# EasyEDA Pro project slimevr_mumo_breakout_module_v1_re.eprj

# Schematic Schematic1
Board Name: Board1; Create Date: 2025-10-01; Page Name: P1; Project Name: slimevr_mumo_breakout_module_v1_re; Schematic Name: Schematic1; Update Date: 2025-10-01; Company: 嘉立创EDA; Page Size: A4; Version: V1.0
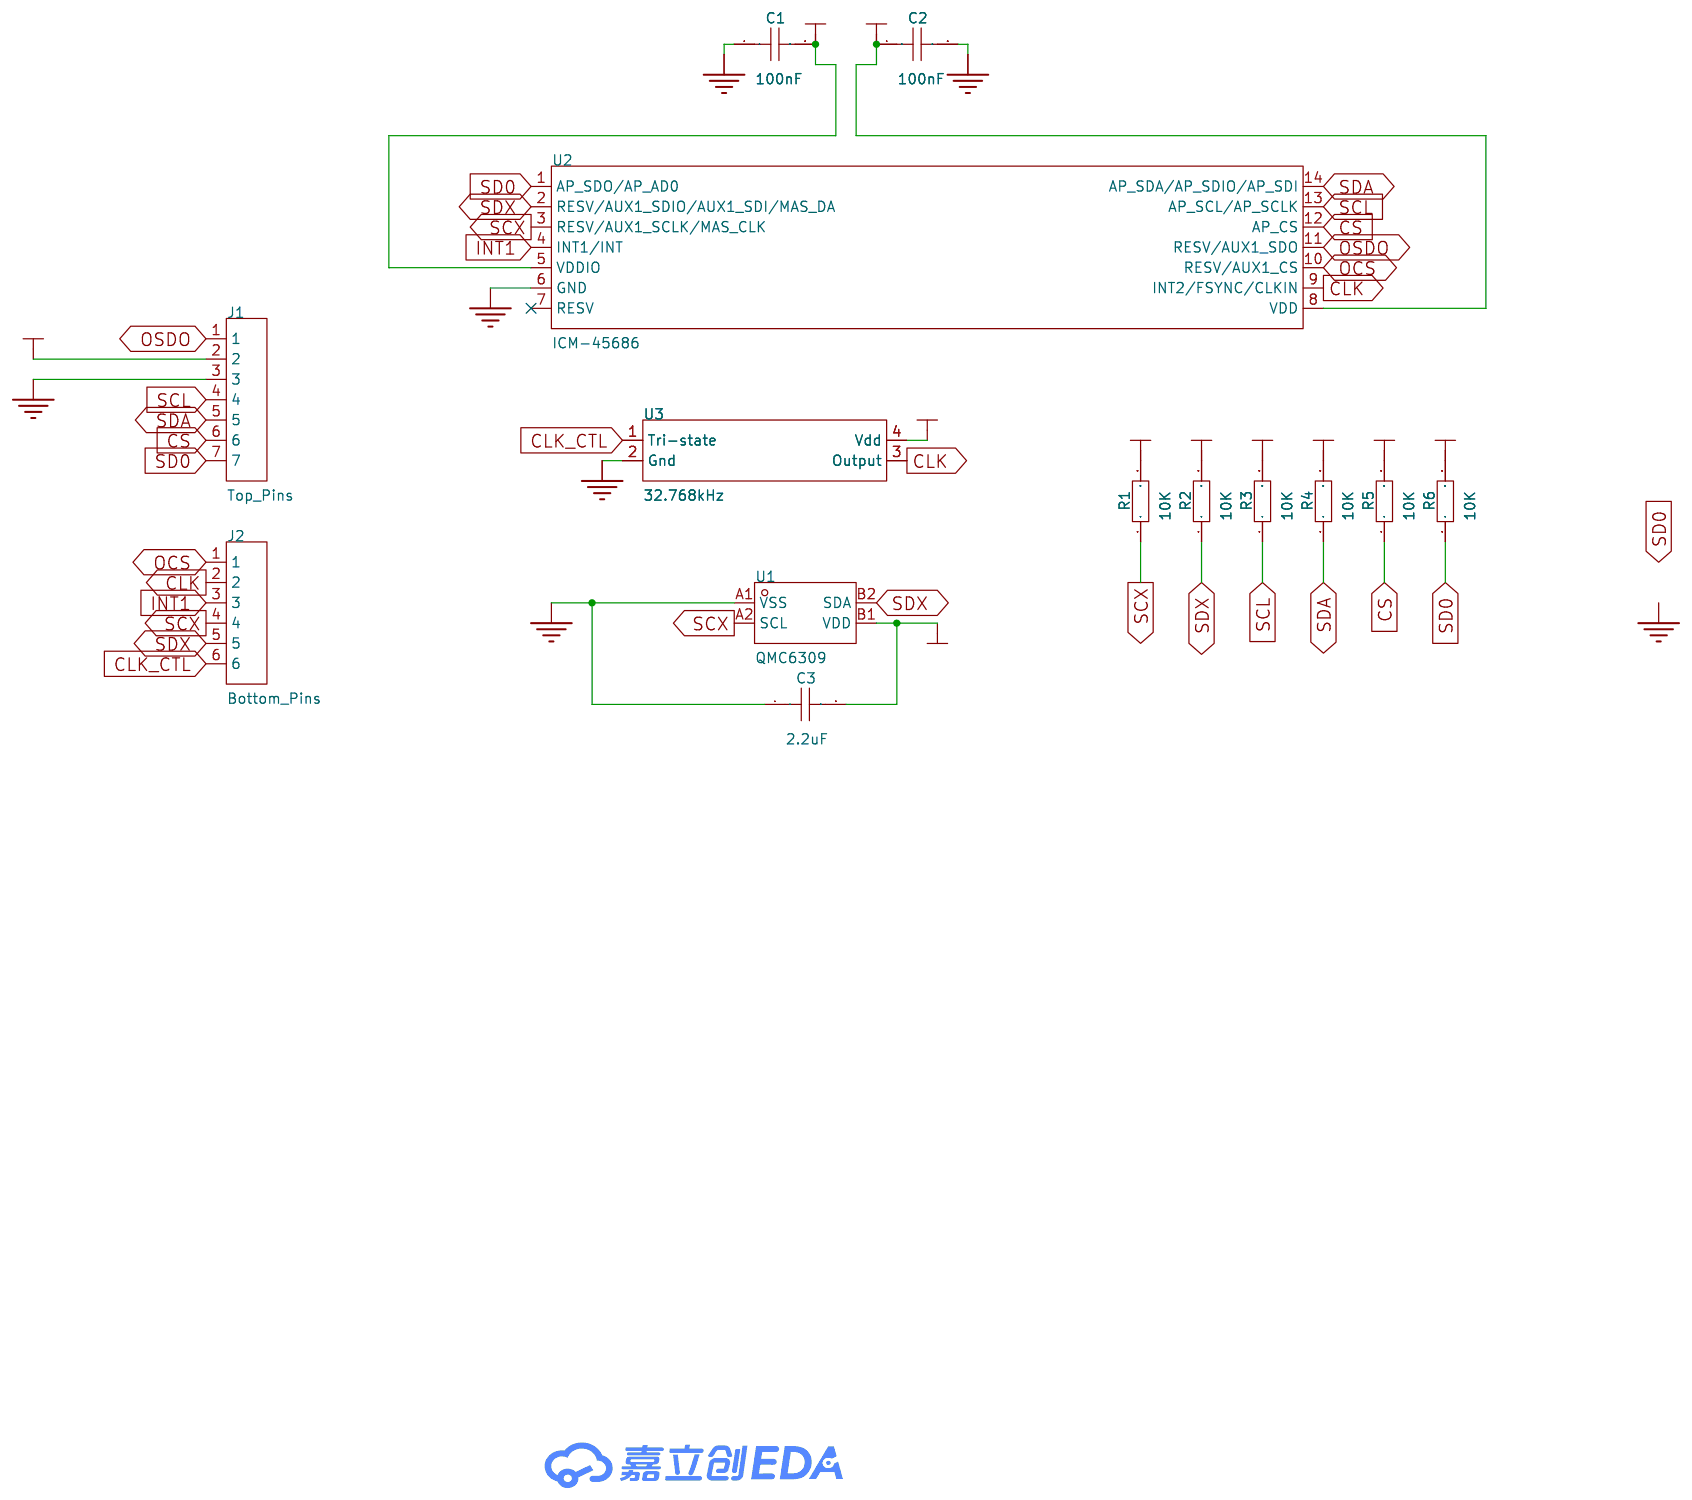
[diagram p0: schematic sheet]

## Parts
C1  100nF  [C0402]
C2  100nF  [C0402]
C3  2.2uF  [C0402]
J1  Top_Pins  [HDR-TH_7P-P2.54-V-M]
J2  Bottom_Pins  [HDR-TH_6P-P2.54-V-M]
R1  10K  [R0402]
R2  10K  [R0402]
R3  10K  [R0402]
R4  10K  [R0402]
R5  10K  [R0402]
R6  10K  [R0402]
U1  QMC6309  [X1-WLB0808-4_L0.8-W0.8-P0.40-TL]
U2  ICM-45686  [LGA-14_L3.0-W2.5-P0.50-TL]
U3  32.768kHz  [OSC-SMD_4P-L3.2-W2.5-BL]

## Library data of the parts
C1-C3 = CAP_0603: Supplier Footprint: 0603
J1 = HB-PH3-25417PB2GOP: LCSC Part Name: 1x7P 间距:2.54mm 方针 直插; Supplier Part: C6332200; Manufacturer: HANBO(汉博); Supplier Footprint: 插件,P=2.54mm; JLCPCB Part Class: 扩展库; Datasheet: https://item.szlcsc.com/datasheet/HB-PH3-25417PB2GOP/7280440.html; Supplier: LCSC; Pin Structure: 1x7P; Pitch: 2.54mm; Row Spacing: 2.54mm; Circluar Pins/Square Pins: 方针; Mounting Type: 直插; Number of Rows: 单排; Number of Pins: 7P; Current Rating: 3A; Voltage Rating (Max): 250V; Length of Mating Pin: 6mm; Insulation Height: 2.54mm; Length of End Connection Pin: 3mm; Contact Material: 黄铜; Contact Plating: 金; Operating Temperature: -40℃~+105℃; Color: 黑色
J2 = HB-PH3-25416PB2GOP: LCSC Part Name: 1x6P 间距:2.54mm 方针 直插; Supplier Part: C6332199; Manufacturer: HANBO(汉博); Supplier Footprint: 插件,P=2.54mm; JLCPCB Part Class: 扩展库; Datasheet: https://item.szlcsc.com/datasheet/HB-PH3-25416PB2GOP/7280439.html; Supplier: LCSC; Pin Structure: 1x6P; Pitch: 2.54mm; Row Spacing: 2.54mm; Circluar Pins/Square Pins: 方针; Mounting Type: 直插; Number of Rows: 单排; Number of Pins: 6P; Current Rating: 3A; Voltage Rating (Max): 250V; Length of Mating Pin: 6mm; Insulation Height: 2.54mm; Length of End Connection Pin: 3mm; Contact Material: 黄铜; Contact Plating: 金; Operating Temperature: -40℃~+105℃; Color: 黑色
R1-R6 = Res_0603: Supplier Footprint: 0603
U1 = QMC6309: Supplier Part: C5439871; Manufacturer: QST(上海矽睿); Supplier Footprint: WLCSP-4(0.8x0.8); JLCPCB Part Class: 扩展库; Datasheet: https://item.szlcsc.com/datasheet/QMC6309/6319593.html; Supplier: LCSC
U2 = ICM-45686: Supplier Part: C22459454; Manufacturer: TDK InvenSense(应美盛); Supplier Footprint: LGA-14(3x2.5); JLCPCB Part Class: 扩展库; Datasheet: https://item.szlcsc.com/datasheet/ICM-45686/24135842.html; Supplier: LCSC
U3 = YF4032K76833T8188081: Supplier Part: C709192; Manufacturer: JWT(晶威特); Supplier Footprint: SMD3225-4P; JLCPCB Part Class: 扩展库; Datasheet: https://atta.szlcsc.com/upload/public/pdf/source/20200819/C709192_B630C027D229E0E1DC55BE73A6BD301E.pdf; Supplier: LCSC; Voltage - Supply: 3.3V; Current - Supply: 70uA; Frequency Stability: ±10ppm; Operating Temperature: -40℃~+85℃

## Nets
+3V3: C1.2 C2.1 C3.2 J1.2 R1.2 R2.2 R3.2 R4.2 R5.2 R6.2 U1.B1(VDD) U2.5(VDDIO) U2.8(VDD) U3.4(Vdd)
GND: C1.1 C2.2 C3.1 J1.3 U1.A1(VSS) U2.6(GND) U3.2(Gnd)
CLK: J2.2 U2.9(INT2/FSYNC/CLKIN) U3.3(Output)
CLK_CTL: J2.6 U3.1(Tri-state)
CS: J1.6 R5.1 U2.12(AP_CS)
INT1: J2.3 U2.4(INT1/INT)
OCS: J2.1 U2.10(RESV/AUX1_CS)
OSDO: J1.1 U2.11(RESV/AUX1_SDO)
SCL: J1.4 R3.1 U2.13(AP_SCL/AP_SCLK)
SCX: J2.4 R1.1 U1.A2(SCL) U2.3(RESV/AUX1_SCLK/MAS_CLK)
SD0: J1.7 R6.1 U2.1(AP_SDO/AP_AD0)
SDA: J1.5 R4.1 U2.14(AP_SDA/AP_SDIO/AP_SDI)
SDX: J2.5 R2.1 U1.B2(SDA) U2.2(RESV/AUX1_SDIO/AUX1_SDI/MAS_DA)

Not connected (* = marked no-connect by the designer): U2 7(RESV)*

# Board PCB1
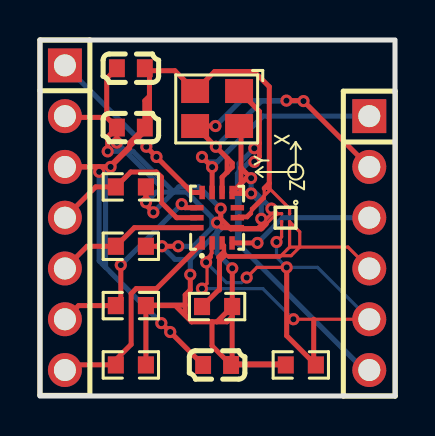
[diagram p1: board, top side]
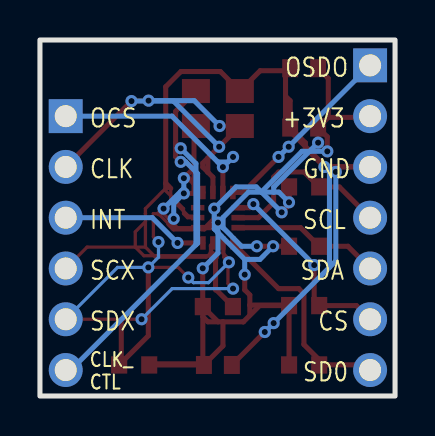
[diagram p2: board, bottom side, seen from below]

Outline 17.78 x 17.81 mm; copper layers: Top Layer, Bottom Layer. Coordinates in mm from the lower left corner of the outline.
Outline path: rectangle 0,17.81 17.78,0
Stack: Top Layer 0.035mm / Dielectric1 1.51mm FR4 er 4.5 / Bottom Layer 0.035mm

## Design rules (mm)
template: JLCPCB Capability(Two Layers Board)
spacing copperThickness1oz (default): track to track 0.102, other pairs 0.152 to 0.3
spacing copperThickness2oz: track to track 0.203, other pairs 0.152 to 0.3
track width copperThickness1oz (default): min 0.127, default 0.254, max 2.54
track width copperThickness2oz: min 0.203, default 0.254, max 2.54
differential pair differentialPair (default): width min 0.127, default 0.254, max 2.54; gap min 0.152, default 0.152
via viaSize (default): diameter min 0.5, default 0.61, max 10; hole min 0.3, default 0.305, max 6.3

## Placement (name value [footprint] x y rotation side)
C1  100nF  [C0603]  4.55 13.43 180 top
C2  100nF  [C0603]  4.55 16.4 0 top
C3  2.2uF  [C0603]  8.87 1.55 0 top
J1  Top_Pins  [HDR-TH_7P-P2.54-V-M]  1.25 8.92 270 top
J2  Bottom_Pins  [HDR-TH_6P-P2.54-V-M]  16.49 7.65 270 top
R1  10K  [R0603]  8.87 4.48 0 top
R2  10K  [R0603]  13.06 1.55 180 top
R3  10K  [R0603]  4.55 10.46 0 top
R4  10K  [R0603]  4.55 7.49 0 top
R5  10K  [R0603]  4.55 4.52 0 top
R6  10K  [R0603]  4.55 1.56 0 top
U1  QMC6309  [X1-WLB0808-4_L0.8-W0.8-P0.40-TL]  12.3 8.92 270 top
U2  ICM-45686  [LGA-14_L3.0-W2.5-P0.50-TL]  8.87 8.92 90 top
U3  32.768kHz  [OSC-SMD_4P-L3.2-W2.5-BL]  8.87 14.38 180 top

## Footprints (pads in the part's own frame, mm; a bottom-side part is the same pattern mirrored in y, then rotated)
C0603
  rect 0.8x0.9 smd: 1(-0.7,0) 2(0.7,0)
HDR-TH_6P-P2.54-V-M
  rect 1.7x1.7 hole 1.1: 1(-6.35,0)
  round 1.7 hole 1.1: 2(-3.81,0) 3(-1.27,0) 4(1.27,0) 5(3.81,0) 6(6.35,0)
HDR-TH_7P-P2.54-V-M
  rect 1.7x1.7 hole 1.1: 1(-7.62,0)
  round 1.7 hole 1.1: 2(-5.08,0) 3(-2.54,0) 4(0,0) 5(2.54,0) 6(5.08,0) 7(7.62,0)
LGA-14_L3.0-W2.5-P0.50-TL
  rect 0.675x0.28 smd: 1(-1.262,0.75) 2(-1.262,0.25) 3(-1.262,-0.25) 4(-1.262,-0.75) 8(1.262,-0.75) 9(1.262,-0.25) 10(1.262,0.25) 11(1.262,0.75)
  rect 0.28x0.675 smd: 5(-0.5,-1.012) 6(0,-1.012) 7(0.5,-1.012) 12(0.5,1.012) 13(0,1.012) 14(-0.5,1.012)
OSC-SMD_4P-L3.2-W2.5-BL
  rect 1.4x1.2 smd: 1(-1.1,-0.875) 2(1.1,-0.875) 3(1.1,0.875) 4(-1.1,0.875)
R0603
  rect 0.806x0.864 smd: 1(-0.753,0) 2(0.753,0)
X1-WLB0808-4_L0.8-W0.8-P0.40-TL
  round 0.18 smd: A1(-0.2,0.2) A2(0.2,0.2) B1(-0.2,-0.2) B2(0.2,-0.2)

## Nets
As in the schematic.

Pads without a net: U2 7

## Via types
v1: diameter 0.61, hole 0.305, Top Layer to Bottom Layer, 37 vias

## Routing (per net, layer and track width the routed paths; a pad name or vN(x,y) marks a point on that pad's centre or on a via; arc(x,y) is an arc through that point)
+3V3: length 82.4
  Top Layer w0.163: 11.84,9.12 11.59,9.12 10.89,8.42 ; 11.84,9.12 11.34,8.61 ; 11.84,9.12 U1.B1 ; 10.89,8.42 U2.5 ; 10.89,8.42 11.15,8.42
  Top Layer w0.254: v1(5.31,9.69) 5.31,10.46 ; 9.62,3.97 R1.2 8.86,3.71 ; 9.62,3.97 9.62,1.61 ; 9.62,3.97 9.37,3.71 8.86,3.71 ; 10.07,10.14 10.07,10.63 ; 10.07,10.14 9.67,10.14 U2.8 10.07,10.63 ; 10.07,10.14 v1(10.57,10.14) ; 10.07,10.63 10.07,11.41 ; 10.07,10.63 10.34,10.9 v1(10.57,10.9) 10.07,11.41 ; 9.62,1.61 12.25,1.61 R2.2 C3.2 ; 9.62,1.61 C3.2 ; v1(6.92,7.49) v1(6.11,7.49) R4.2 ; R5.2 R6.2 ; R5.2 6.78,4.52 7.59,3.71 ; R5.2 5.33,4.55 7.27,4.55 ; 8.86,3.71 8.62,3.71 ; 8.62,3.71 8.62,2.51 C3.2 ; 8.62,3.71 7.59,3.71 ; C1.2 3.34,13.94 ; C1.2 v1(3.85,12.67) ; C1.2 3.39,12.97 v1(3.39,12.24) ; 3.34,13.94 3.34,15.89 C2.1 ; 3.34,13.94 1.31,13.94 J1.2 ; 11.84,9.12 v1(11.59,9.37) ; U3.4 10.07,13.41 10.07,11.41 ; 9.5,8.42 9.05,8.87 v1(9.05,9.37) ; 9.5,8.42 9.12,8.42 v1(8.87,8.67) ; 9.5,8.42 U2.5 ; 9.5,8.42 9.56,8.36 11.08,8.36 11.34,8.61 ; R3.2 5.31,9.56 v1(5.68,9.19) ; 7.27,4.55 7.27,5.06 7.53,5.31 v1(7.53,6.07) ; 7.27,4.55 7.27,4.04 ; v1(9.63,6.39) 9.63,4.48 ; 7.59,3.71 7.6,3.71 ; 11.08,8.61 v1(11.08,8.87)
  Bottom Layer w0.254: 8.61,8.42 7.68,7.49 v1(6.92,7.49) ; 8.61,8.42 8.61,8.93 7.34,10.2 6.69,10.2 ; 8.61,8.42 v1(8.87,8.67) 8.87,8.17 ; 6.07,10.2 6.07,10.45 4.29,12.24 ; 6.07,10.2 5.82,10.2 v1(5.31,9.69) ; 6.07,10.2 6.69,10.2 ; 4.29,12.24 v1(3.85,12.67) ; 4.29,12.24 v1(3.39,12.24) ; 4.29,12.24 4.66,12.24 6.69,10.21 ; v1(11.59,9.37) 10.57,10.39 v1(10.57,10.9) ; 7.53,6.83 6.76,6.83 v1(6.11,7.49) ; 7.53,6.83 8.87,8.17 ; 7.53,6.83 v1(7.53,6.07) ; 6.69,10.2 v1(5.68,9.19) ; 6.69,10.2 6.69,10.21 ; 8.87,8.17 9.05,8.36 v1(9.05,9.37) 7.96,10.46 6.95,10.46 6.69,10.21 ; 8.87,8.17 8.87,7.15 v1(9.63,6.39) ; v1(11.08,8.87) 11.08,9.63 v1(10.57,10.14)
GND: length 51.8
  Top Layer w0.163: 11.23,10.01 11.23,10.39 11.48,10.39 ; 11.23,10.01 10.59,9.37 10.59,9.25 ; 11.23,10.01 11.23,9.89 10.59,9.25 ; 11.23,10.01 11.48,10.27 11.48,10.39 ; 10.59,9.25 10.59,9.12 10.39,8.92 U2.6 9.96,9 10.34,9 10.59,9.25 ; 11.48,10.39 12.5,9.37 U1.A1
  Top Layer w0.254: 4.49,12.48 5.25,13.25 C1.1 ; 4.49,12.48 3.47,11.47 2.97,11.47 ; 4.49,12.48 4.49,12.67 C1.1 ; 4.49,12.48 4.49,12.41 v1(3.54,11.46) 2.97,11.46 ; C2.2 5.38,16.27 5.48,16.27 ; C3.1 v1(6.52,3.2) v1(6.08,3.65) ; 5.48,16.27 5.48,15 ; 5.48,16.27 6.75,16.27 U3.2 8.75,16.23 10.72,16.23 11.48,15.47 11.48,10.64 ; 5.48,15 5.48,13.66 C1.1 ; 5.48,15 5.25,14.77 C1.1 ; 2.97,11.46 J1.3 1.26,11.47 2.97,11.47 ; 2.97,11.46 2.97,11.47 ; 2.97,11.46 v1(2.97,11.21) ; 11.23,10.39 11.48,10.64 ; 11.48,10.64 11.48,10.39
  Bottom Layer w0.254: v1(2.97,11.21) 2.97,6.76 3.28,6.44 ; 3.28,6.44 3.28,11.21 v1(3.54,11.46) ; 3.28,6.44 v1(6.08,3.65) v1(6.52,3.2)
CLK: length 21
  Top Layer w0.254: U2.9 9.12,10.94 9.37,11.2 ; 9.37,11.2 9.63,11.45 9.63,11.65 9.37,11.9 ; 9.37,11.2 9.37,11.9 ; 9.37,11.9 v1(8.81,12.47) U3.3 v1(8.79,13.51) ; J2.2 13.17,14.78 v1(12.34,14.78)
  Bottom Layer w0.254: v1(13.2,14.75) 11.09,14.75 v1(8.81,12.47) ; v1(12.34,14.78) 10.06,14.78 v1(8.79,13.51)
CLK_CTL: length 23.4
  Top Layer w0.254: v1(10.73,11.71) 10.99,11.97 10.99,12.65 ; 10.99,12.65 10.99,14.24 U3.1 ; 10.99,12.65 v1(10.73,12.39)
  Bottom Layer w0.254: 9.97,7.57 16.24,1.3 J2.6 ; 9.97,7.57 9.97,11.21 ; 9.97,7.57 9.89,7.65 9.89,11.12 9.97,11.21 ; 9.97,11.21 9.97,11.63 v1(10.73,12.39) ; 9.97,11.21 10.48,11.71 v1(10.73,11.71)
CS: length 10.1
  Top Layer w0.254: J1.6 1.93,4.52 R5.1 4.05,4.77 v1(4.05,6.55) ; v1(7.1,9.6) 7.27,9.42 U2.12
  Bottom Layer w0.254: v1(7.1,9.6) v1(4.05,6.55)
INT1: length 7.4
  Top Layer w0.254: U2.4 v1(10.89,7.66)
  Bottom Layer w0.254: J2.3 12.15,8.92 v1(10.89,7.66)
OCS: length 11.8
  Top Layer w0.254: U2.10 v1(8.62,11.45) v1(8.11,11.96)
  Bottom Layer w0.254: 8.87,11.71 11.17,14 J2.1 ; 8.87,11.71 v1(8.62,11.45) ; 8.87,11.71 8.37,11.71 v1(8.11,11.96)
OSDO: length 10.2
  Top Layer w0.254: U2.11 7.61,10.18 v1(5.83,11.96) v1(5.33,12.47)
  Bottom Layer w0.254: v1(5.83,11.96) 5.33,12.47 J1.1
SCL: length 9.2
  Top Layer w0.254: J1.4 2.79,10.46 R3.1 4.54,11.21 5.83,11.21 6.08,10.95 6.08,9.68 6.84,8.92 U2.13
SCX: length 19.4
  Top Layer w0.163: 9.2,7.58 U2.3 ; 9.2,7.58 9.24,7.54 9.24,7.15 ; 9.2,7.58 9.2,7.2 9.24,7.15 ; J2.4 15.42,7.45 13.01,7.45 ; 12.07,7.02 11.99,6.94 9.45,6.94 9.37,7.02 ; 12.07,7.02 9.37,7.02 ; 12.07,7.02 12.58,7.02 13.01,7.45 ; 12.07,7.02 12.5,7.45 ; 9.37,7.02 9.24,7.15 ; 9.37,7.02 9.24,7.02 9.24,7.15 ; 12.5,7.45 U1.A2 13.01,8.21 13.01,7.45 ; 12.5,7.45 13.01,7.45
  Top Layer w0.254: 8.99,6.94 8.99,6.77 ; 8.99,6.77 9.24,7.02 ; 8.99,6.77 8.99,5.35 ; 8.99,5.35 R1.1 ; 8.99,5.35 8.99,5.3 ; 9.2,7.2 8.94,6.94
SD0: length 11.1
  Top Layer w0.254: 3.8,1.56 1.51,1.56 J1.7 ; 3.8,1.56 R6.1 ; 3.8,1.56 3.8,1.82 4.56,2.58 4.56,5.12 4.82,5.37 5.83,5.37 U2.1
SDA: length 7.5
  Top Layer w0.254: U2.14 4.73,8.42 R4.1 2.36,7.49 J1.5
SDX: length 32.9
  Top Layer w0.163: v1(10.35,5.93) 10.86,6.43 v1(12.35,6.43) ; U1.B2 12.1,7.96 v1(11.84,7.7) ; 8.57,7.1 8.62,7.15 U2.2 8.57,7.61 8.57,7.1 ; 8.57,7.1 8.37,6.9 8.37,6.73 ; 8.57,7.1 8.57,6.94 8.37,6.73 ; v1(8.32,6.69) 8.37,6.73 ; 8.37,6.73 8.37,5.63 v1(8.11,5.37) ; v1(12.69,3.84) J2.5
  Top Layer w0.254: 13.71,1.66 12.35,3.02 v1(12.35,6.43) ; 13.71,1.66 R2.1 ; 13.71,1.66 13.71,3.84
  Bottom Layer w0.163: v1(12.69,3.84) 11.16,5.37 v1(8.11,5.37) ; J2.5 13.9,6.43 v1(12.35,6.43) 11.84,6.94 v1(11.84,7.7) ; v1(8.32,6.69) 9.34,5.67 10.1,5.67 v1(10.35,5.93)

## Text on the board
Bottom Silkscreen Layer: CLK_ / CTL | CS | GND | SCL | SD0 | SDA | OSDO | +3V3 | OCS | CLK | INT | SCX | SDX
Top Silkscreen Layer: Y | X | Z
